# Altium project 5_step_seq.PrjPcb
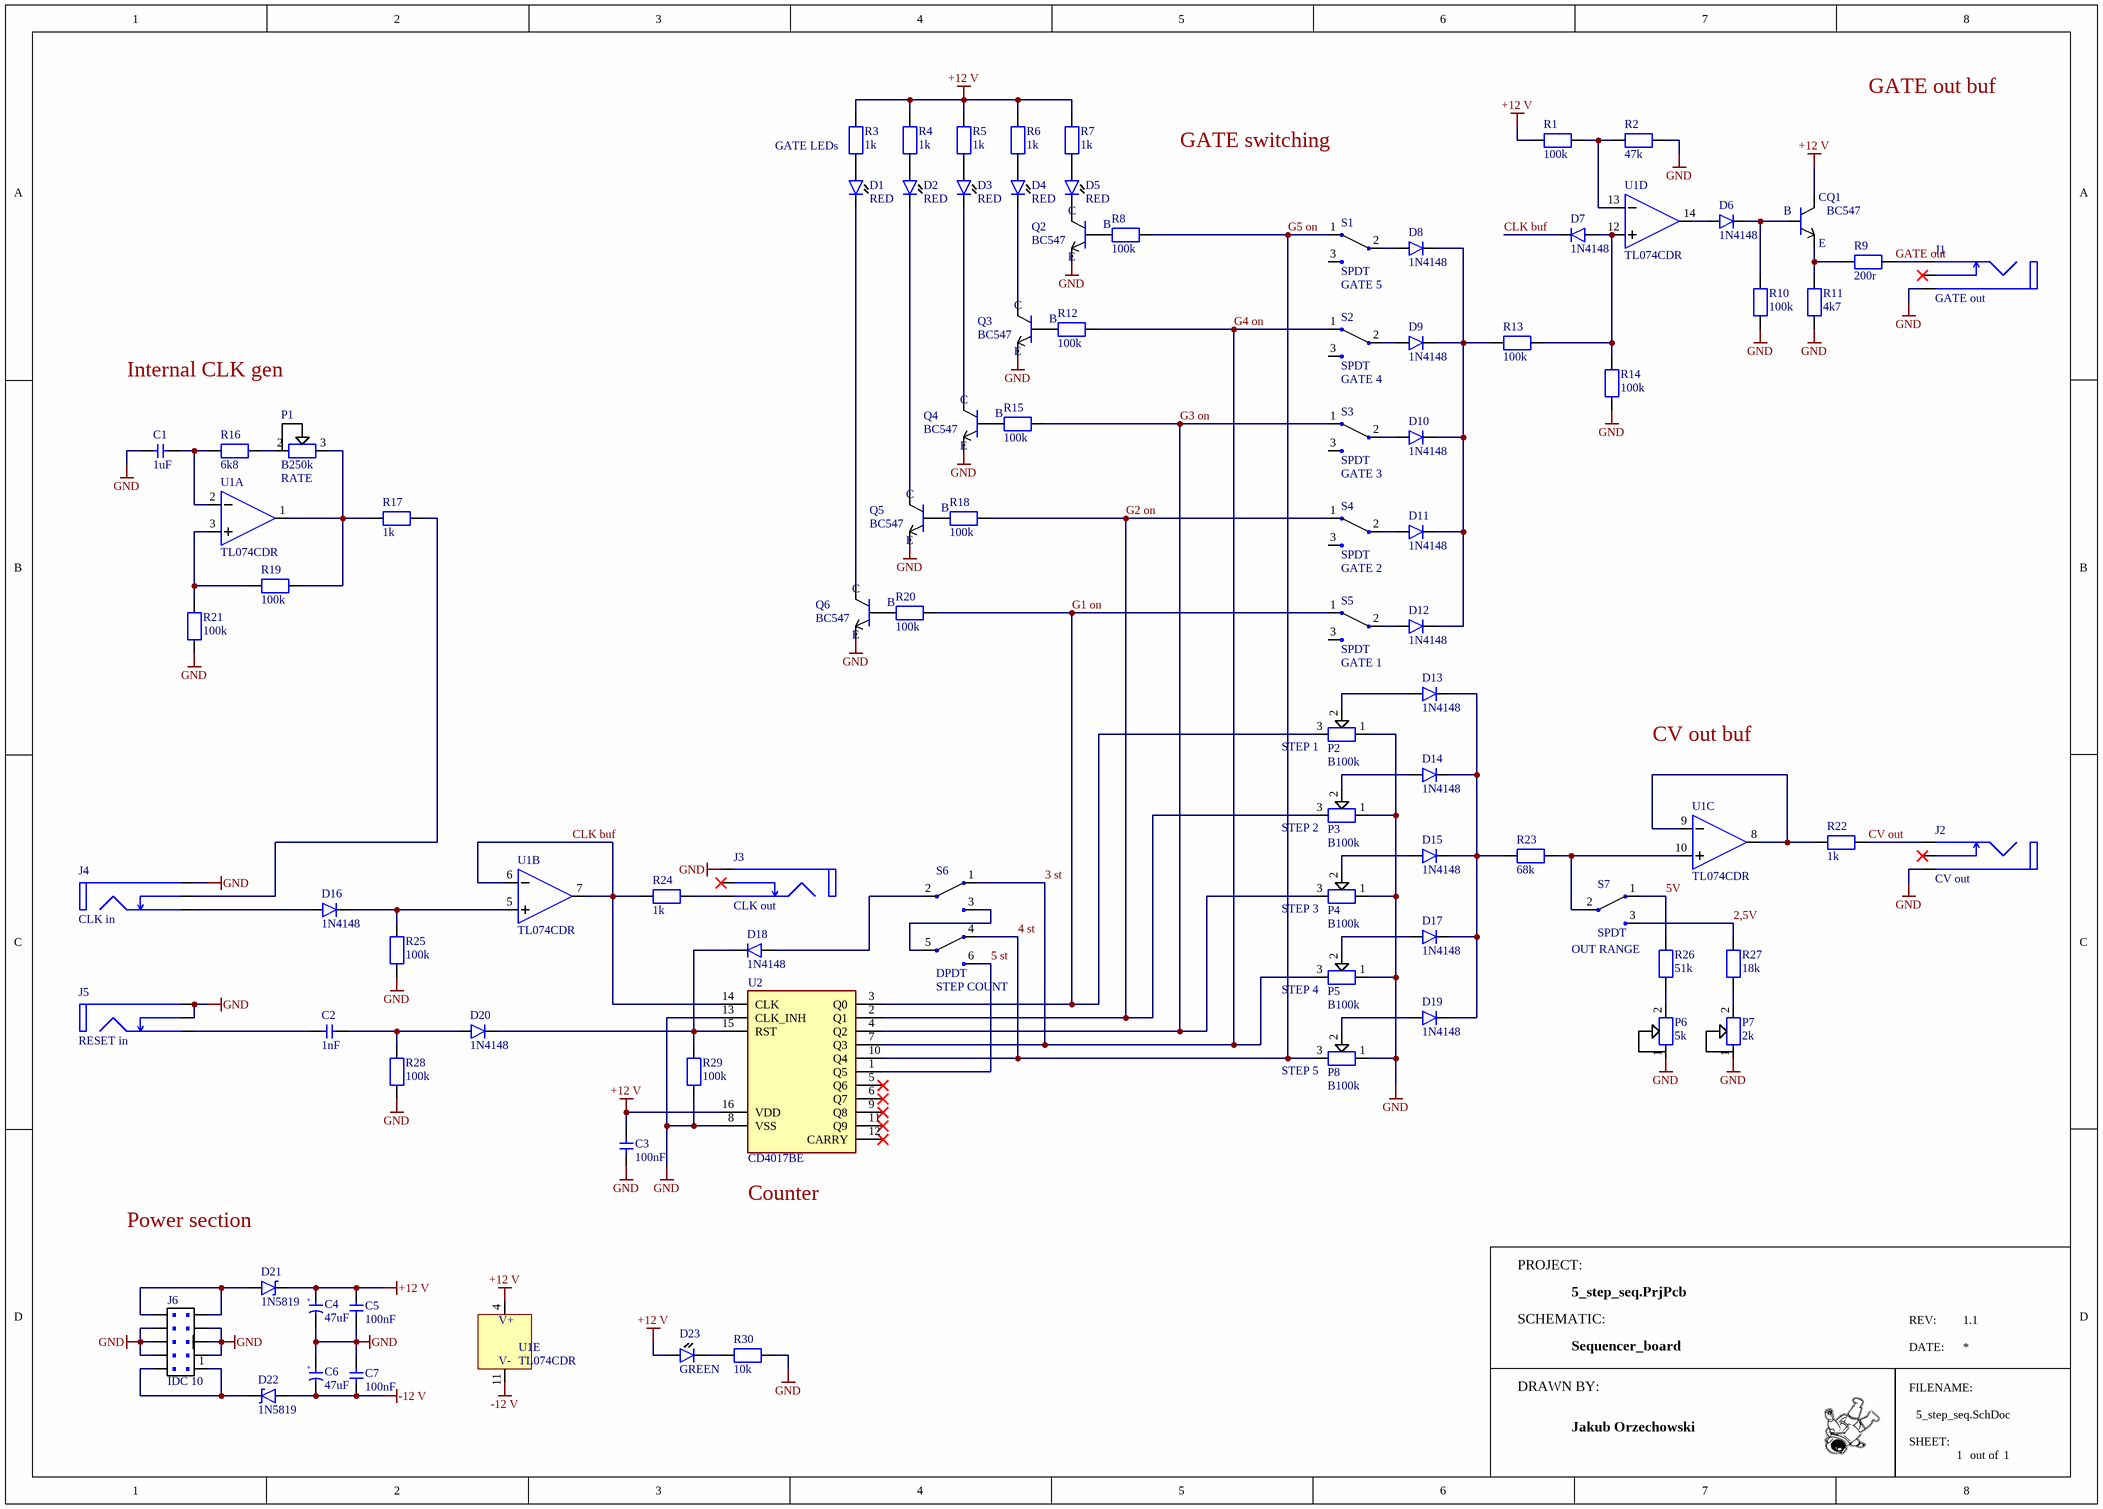
[diagram p0: 5_step_seq.SchDoc]
1 sheet, 89 parts. Net scope: global (net labels, ports and power ports of the same name join across sheets).
Board file: 5_step_seq.PcbDoc

## Sheet 5_step_seq.SchDoc: Sequencer_board
size A3; Author: Jakub Orzechowski; DrawnBy: Jakub Orzechowski; Engineer: aa; Revision: 1.1; SheetNumber: 1; SheetTotal: 1

### Parts
C1  value 1uF  [Cap THT 5mm]  (hidden comment: CAP)
C2  value 1nF  [Cap THT 5mm]  (hidden comment: CAP)
C3  value 100nF  [Cap THT 5mm]  (hidden comment: CAP)
C4  value 47uF  [Cap electrolytic THT 5mm]  (hidden comment: CAP)
C5  value 100nF  [Cap THT 5mm]  (hidden comment: CAP)
C6  value 47uF  [Cap electrolytic THT 5mm]  (hidden comment: CAP)
C7  value 100nF  [Cap THT 5mm]  (hidden comment: CAP)
D1  Color: RED  [LED THT 5 mm raised]  (hidden comment: LED)
D2  Color: RED  [LED THT 5 mm raised]  (hidden comment: LED)
D3  Color: RED  [LED THT 5 mm raised]  (hidden comment: LED)
D4  Color: RED  [LED THT 5 mm raised]  (hidden comment: LED)
D5  Color: RED  [LED THT 5 mm raised]  (hidden comment: LED)
D6  Model: 1N4148  [Diode THT 10 mm]  (hidden comment: DIODE)
D7  Model: 1N4148  [Diode THT 10 mm]  (hidden comment: DIODE)
D8  Model: 1N4148  [Diode THT 10 mm]  (hidden comment: DIODE)
D9  Model: 1N4148  [Diode THT 10 mm]  (hidden comment: DIODE)
D10  Model: 1N4148  [Diode THT 10 mm]  (hidden comment: DIODE)
D11  Model: 1N4148  [Diode THT 10 mm]  (hidden comment: DIODE)
D12  Model: 1N4148  [Diode THT 10 mm]  (hidden comment: DIODE)
D13  Model: 1N4148  [Diode THT 10 mm]  (hidden comment: DIODE)
D14  Model: 1N4148  [Diode THT 10 mm]  (hidden comment: DIODE)
D15  Model: 1N4148  [Diode THT 10 mm]  (hidden comment: DIODE)
D16  Model: 1N4148  [Diode THT 10 mm]  (hidden comment: DIODE)
D17  Model: 1N4148  [Diode THT 10 mm]  (hidden comment: DIODE)
D18  Model: 1N4148  [Diode THT 10 mm]  (hidden comment: DIODE)
D19  Model: 1N4148  [Diode THT 10 mm]  (hidden comment: DIODE)
D20  Model: 1N4148  [Diode THT 10 mm]  (hidden comment: DIODE)
D21  Model: 1N5819  [Diode THT 10 mm]  (hidden comment: SCHOTTKY)
D22  Model: 1N5819  [Diode THT 10 mm]  (hidden comment: SCHOTTKY)
D23  Color: GREEN  [LED SMD 0805]  (hidden comment: LED)
J1  Label: GATE out  [PJ301M]  (hidden comment: JACK Mono)
J2  Label: CV out  [PJ301M]  (hidden comment: JACK Mono)
J3  Label: CLK out  [PJ301M]  (hidden comment: JACK Mono)
J4  Label: CLK in  [PJ301M]  (hidden comment: JACK Mono)
J5  Label: RESET in  [PJ301M]  (hidden comment: JACK Mono)
J6  IDC 10  [IDC 10 PIN]
P1  value B250k  Parameter: RATE  [9 mm PCB Potentiometer]  (hidden comment: VR)
P2  value B100k  Parameter: STEP 1  [9 mm PCB Potentiometer]  (hidden comment: Mono Pot)
P3  value B100k  Parameter: STEP 2  [9 mm PCB Potentiometer]  (hidden comment: Mono Pot)
P4  value B100k  Parameter: STEP 3  [9 mm PCB Potentiometer]  (hidden comment: Mono Pot)
P5  value B100k  Parameter: STEP 4  [9 mm PCB Potentiometer]  (hidden comment: Mono Pot)
P6  value 5k  [Multiturn Potentiometer inline]  (hidden comment: VR)
P7  value 2k  [Multiturn Potentiometer inline]  (hidden comment: VR)
P8  value B100k  Parameter: STEP 5  [9 mm PCB Potentiometer]  (hidden comment: Mono Pot)
Q1  BC547  [TO-92 wide]
Q2  BC547  [TO-92 wide]
Q3  BC547  [TO-92 wide]
Q4  BC547  [TO-92 wide]
Q5  BC547  [TO-92 wide]
Q6  BC547  [TO-92 wide]
R1  value 100k  [Resistor THT vertical]  (hidden comment: RES)
R2  value 47k  [Resistor THT vertical]  (hidden comment: RES)
R3  value 1k  [Resistor THT vertical]  (hidden comment: RES)
R4  value 1k  [Resistor THT vertical]  (hidden comment: RES)
R5  value 1k  [Resistor THT vertical]  (hidden comment: RES)
R6  value 1k  [Resistor THT vertical]  (hidden comment: RES)
R7  value 1k  [Resistor THT vertical]  (hidden comment: RES)
R8  value 100k  [Resistor THT 10mm]  (hidden comment: RES)
R9  value 200r  [Resistor THT vertical]  (hidden comment: RES)
R10  value 100k  [Resistor THT vertical]  (hidden comment: RES)
R11  value 4k7  [Resistor THT vertical]  (hidden comment: RES)
R12  value 100k  [Resistor THT 10mm]  (hidden comment: RES)
R13  value 100k  [Resistor THT vertical]  (hidden comment: RES)
R14  value 100k  [Resistor THT vertical]  (hidden comment: RES)
R15  value 100k  [Resistor THT 10mm]  (hidden comment: RES)
R16  value 6k8  [Resistor THT 10mm]  (hidden comment: RES)
R17  value 1k  [Resistor THT 10mm]  (hidden comment: RES)
R18  value 100k  [Resistor THT 10mm]  (hidden comment: RES)
R19  value 100k  [Resistor THT 10mm]  (hidden comment: RES)
R20  value 100k  [Resistor THT 10mm]  (hidden comment: RES)
R21  value 100k  [Resistor THT 10mm]  (hidden comment: RES)
R22  value 1k  [Resistor THT 10mm]  (hidden comment: RES)
R23  value 68k  [Resistor THT 10mm]  (hidden comment: RES)
R24  value 1k  [Resistor THT vertical]  (hidden comment: RES)
R25  value 100k  [Resistor THT 10mm]  (hidden comment: RES)
R26  value 51k  [Resistor THT vertical]  (hidden comment: RES)
R27  value 18k  [Resistor THT vertical]  (hidden comment: RES)
R28  value 100k  [Resistor THT 10mm]  (hidden comment: RES)
R29  value 100k  [Resistor THT 10mm]  (hidden comment: RES)
R30  value 10k  [Resistor SMD 0805]  (hidden comment: RES)
S1  SPDT  Signals: GATE 5  [2MS1T1B5M2RE]
S2  SPDT  Signals: GATE 4  [2MS1T1B5M2RE]
S3  SPDT  Signals: GATE 3  [2MS1T1B5M2RE]
S4  SPDT  Signals: GATE 2  [2MS1T1B5M2RE]
S5  SPDT  Signals: GATE 1  [2MS1T1B5M2RE]
S6  DPDT  Signals: STEP COUNT  [2MD6T1B5M2RE]
S7  SPDT  Signals: OUT RANGE  [2MS1T1B5M2RE]
U1  TL074CDR  [SOIC14]  (parts A,B,C,D,E of 5)
U2  CD4017BE  [DIP-16 socket]

### Nets
+12 V: C3.2 C4.2 C5.2 D21.2 D23.1 Q1.1 R1.1 R3.2 R4.2 R5.2 R6.2 R7.2 U1.4 U2.16(VDD)
-12 V: C6.1 C7.1 D22.1 U1.11
GND: C1.1 C3.1 C4.1 C5.1 C6.2 C7.2 J1.1 J2.1 J3.1 J4.1 J5.1 J5.2 J6.3 J6.4 J6.5 J6.6 J6.7 J6.8 P2.1 P3.1 P4.1 P5.1 P6.1 P7.1 P8.1 Q2.3 Q3.3 Q4.3 Q5.3 Q6.3 R2.2 R10.2 R11.2 R14.1 R21.1 R25.1 R28.1 R29.1 R30.2 U2.8(VSS) U2.13(CLK_INH)
2,5V: R27.1 S7.3
3 st: P5.3 R12.2 S2.1 S6.1 U2.7(Q3)  [also labelled G4 on]
4 st: P8.3 R8.2 S1.1 S6.4 U2.10(Q4)  [also labelled G5 on]
5 st: S6.6 U2.1(Q5)
5V: R26.1 S7.1
CLK buf: D7.2 R24.2 U1.6 U1.7 U2.14(CLK)
CV out: J2.3 R22.1
G1 on: P2.3 R20.2 S5.1 U2.3(Q0)
G2 on: P3.3 R18.2 S4.1 U2.2(Q1)
G3 on: P4.3 R15.2 S3.1 U2.4(Q2)
GATE out: J1.3 R9.1
NetC1_2: C1.2 R16.1 U1.2
NetC2_1: C2.1 J5.3
NetC2_2: C2.2 D20.1 R28.2
NetD1_1: D1.1 R3.1
NetD1_2: D1.2 Q6.1
NetD2_1: D2.1 R4.1
NetD2_2: D2.2 Q5.1
NetD3_1: D3.1 R5.1
NetD3_2: D3.2 Q4.1
NetD4_1: D4.1 R6.1
NetD4_2: D4.2 Q3.1
NetD5_1: D5.1 R7.1
NetD5_2: D5.2 Q2.1
NetD6_1: D6.1 U1.14
NetD6_2: D6.2 Q1.2 R10.1
NetD7_1: D7.1 R13.2 R14.2 U1.12
NetD8_1: D8.1 S1.2
NetD8_2: D8.2 D9.2 D10.2 D11.2 D12.2 R13.1
NetD9_1: D9.1 S2.2
NetD10_1: D10.1 S3.2
NetD11_1: D11.1 S4.2
NetD12_1: D12.1 S5.2
NetD13_1: D13.1 P2.2
NetD13_2: D13.2 D14.2 D15.2 D17.2 D19.2 R23.2
NetD14_1: D14.1 P3.2
NetD15_1: D15.1 P4.2
NetD16_1: D16.1 J4.3
NetD16_2: D16.2 R25.2 U1.5
NetD17_1: D17.1 P5.2
NetD18_1: D18.1 S6.2
NetD18_2: D18.2 D20.2 R29.2 U2.15(RST)
NetD19_1: D19.1 P8.2
NetD21_1: D21.1 J6.9 J6.10
NetD22_2: D22.2 J6.1 J6.2
NetD23_2: D23.2 R30.1
NetJ3_3: J3.3 R24.1
NetJ4_2: J4.2 R17.2
NetP1_2: P1.2 R16.2
NetP1_3: P1.3 R17.1 R19.2 U1.1
NetP6_2: P6.2 R26.2
NetP7_2: P7.2 R27.2
NetQ1_3: Q1.3 R9.2 R11.1
NetQ2_2: Q2.2 R8.1
NetQ3_2: Q3.2 R12.1
NetQ4_2: Q4.2 R15.1
NetQ5_2: Q5.2 R18.1
NetQ6_2: Q6.2 R20.1
NetR1_2: R1.2 R2.1 U1.13
NetR19_1: R19.1 R21.2 U1.3
NetR22_2: R22.2 U1.8 U1.9
NetR23_1: R23.1 S7.2 U1.10
NetS6_3: S6.3 S6.5

Not connected (* = marked no-connect by the designer): J1 2*; J2 2*; J3 2*; S1 3; S2 3; S3 3; S4 3; S5 3; U2 5(Q6)* 6(Q7)* 9(Q8)* 11(Q9)* 12(CARRY)*

### Notes on the sheet
- GATE out buf
- GATE LEDs
- GATE switching
- Internal CLK gen
- CV out buf
- Power section
- (near U2) Counter
- PROJECT:
- SCHEMATIC:
- REV:
- DRAWN BY:
- DATE:
- FILENAME:
- SHEET:
- out of
- (in symbol BC547) C; B; E
- (in symbol Capacitor Electr THT 5mm) +
- (in symbol TL074CDR SOIC14, part E) V+; V-

### Library data of the parts
C1-C3 C5 C7 = Capacitor THT 5mm: THT Capacitor Non-Polarised 5 mm Pitch; Voltage rating: *; Tolerance: *; Package Type: THT
C4 C6 = Capacitor Electr THT 5mm: THT Electrolytic Capacitor 5 mm Diameter; Voltage rating: 16V; Tolerance: *; Package Type: THT
D1-D5 = LED THT: THT LED Diode 5 mm Diameter; Forward voltage: *; Package Type: THT; Type: LED
D6-D20 = Diode THT: Generic THT Axial Diode 10 mm Pitch; Max reverse voltage: *; Max current: *; Forward voltage: *; Package Type: THT; Type: Diode
D21 D22 = Schottky Diode THT: Generic THT Axial Schottky Diode 10 mm Pitch; Max Reverse Voltage: *; Max Current: *; Package Type: THT; Type: Schottky
D23 = LED SMD: SMD LED Diode 0805 Package; Forward voltage: *; Package Type: SMD; Type: LED
J1-J5 = PJ301M: PJ301M Eurorack 3,5 mm Patch Socket PCB Mount; Package Type: THT
J6 = IDC 10 pin: 10 Pin IDC Connector
P1 = VR B 9 mm: PCB Mount 9mm Mono Potentiometer THT as Variable Resistor Clockwise Decrease; Taper: *; Package Type: THT; Type: Potentiometer
P2-P5 P8 = Potentiometer 9 mm: PCB Mount 9mm Mono Potentiometer THT; Taper: *; Package Type: THT; Type: Potentiometer
P6 P7 = VR A Multiturn THT: PCB Mount Multiturn Trimmer Potentiometer Top Adjustable as Variable Resistor Clockwise Increase; Taper: *; Package Type: THT; Type: Potentiometer; Parameter: *
Q1-Q6 = BC547: BC547 NPN Transistor THT TO-92 Package; Package Type: THT; Type: NPN Transistor; Package: TO-92; Group: *
R1-R29 = Resistor THT: THT Axial Resistor 10mm Pitch; Tolerance: *; Package Type: THT
R30 = Resistor SMD 0805: SMD Resistor 0805 package; Tolerance: *; Package Type: SMD
S1-S5 S7 = 2MS1T1B5M2RE SPDT (Eurorack): Single Pole Double Throw on-on Switch; Package Type: THT; Type: Switch
S6 = 2MD6T1B5M2RE DPDT (Eurorack): Dual Pole Dual Throw on-on-on Switch; Package Type: THT; Type: Switch
U1 = TL074CDR SOIC14: TL074CDR Quad Op-Amp SOIC14 Package; Type: Op Amp; Package Type: SMD; Package: SOIC14
U2 = CD4017BE DIP-16: CD4017BE CMOS Decade Counter DIP-16 Package; Type: Counter; Package Type: THT; Package: DIP-16